# Altium schematic sheet Top Level.SchDoc
size A4
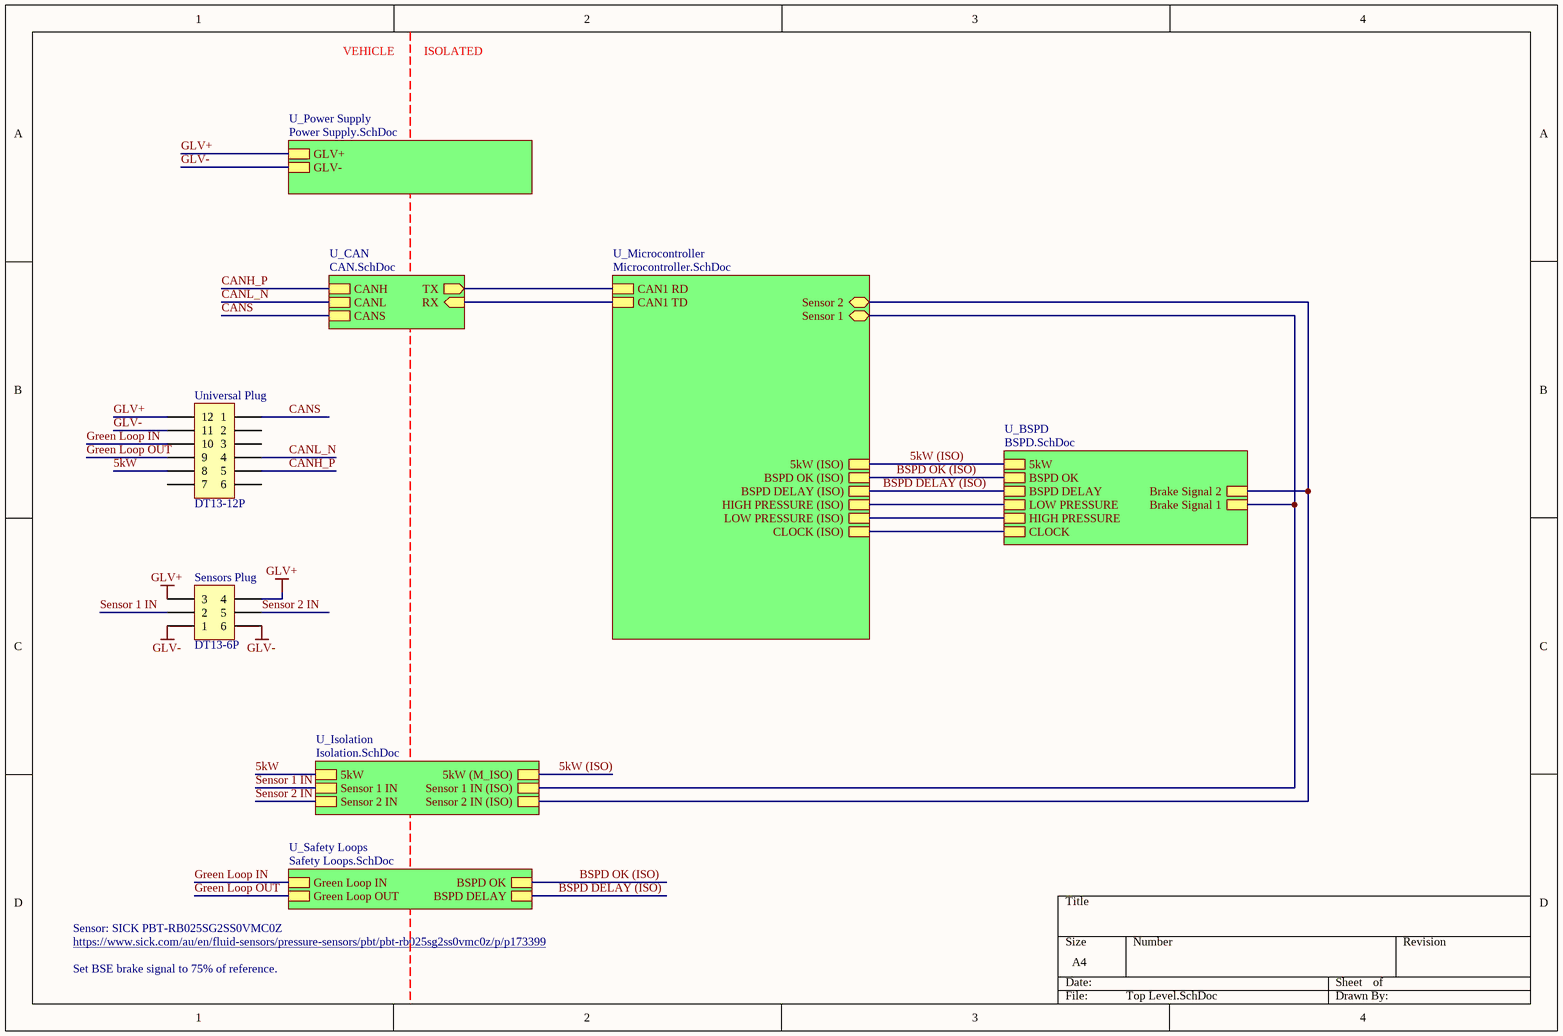
[diagram p0: Top Level.SchDoc]

## Parts
Sensors_Plug  DT13-6P  [DT13-6P]
Universal_Plug  DT13-12P  [DT13-12P]

## Sub-sheets
U_BSPD = BSPD.SchDoc: BSPD OK, HIGH PRESSURE, LOW PRESSURE, CLOCK, 5kW, Brake Signal 1, Brake Signal 2, BSPD DELAY
U_CAN = CAN.SchDoc: CANS, RX (in), CANL, CANH, TX (out)
U_Isolation = Isolation.SchDoc: 5kW, 5kW (M_ISO), Sensor 2 IN, Sensor 1 IN, Sensor 2 IN (ISO), Sensor 1 IN (ISO)
U_Microcontroller = Microcontroller.SchDoc: BSPD OK (ISO), 5kW (ISO), CLOCK (ISO), HIGH PRESSURE (ISO), LOW PRESSURE (ISO), Sensor 2 (bidir), Sensor 1 (bidir), CAN1 RD, CAN1 TD, BSPD DELAY (ISO)
U_Power Supply = Power Supply.SchDoc: GLV+, GLV-
U_Safety Loops = Safety Loops.SchDoc: Green Loop OUT, Green Loop IN, BSPD OK, BSPD DELAY

## Nets
GLV+: Sensors_Plug.3 Sensors_Plug.4 Universal_Plug.12 ; sheet U_Power Supply/GLV+
GLV-: Sensors_Plug.1 Sensors_Plug.6 Universal_Plug.11 ; sheet U_Power Supply/GLV-
5kW: Universal_Plug.8 ; sheet U_Isolation/5kW
5kW (ISO): sheet U_BSPD/5kW, sheet U_Microcontroller/5kW (ISO), sheet U_Isolation/5kW (M_ISO)
BSPD DELAY (ISO): sheet U_BSPD/BSPD DELAY, sheet U_Microcontroller/BSPD DELAY (ISO), sheet U_Safety Loops/BSPD DELAY
BSPD OK (ISO): sheet U_BSPD/BSPD OK, sheet U_Microcontroller/BSPD OK (ISO), sheet U_Safety Loops/BSPD OK
CANH_P: Universal_Plug.5 ; sheet U_CAN/CANH
CANL_N: Universal_Plug.4 ; sheet U_CAN/CANL
CANS: Universal_Plug.1 ; sheet U_CAN/CANS
Green Loop IN: Universal_Plug.10 ; sheet U_Safety Loops/Green Loop IN
Green Loop OUT: Universal_Plug.9 ; sheet U_Safety Loops/Green Loop OUT
Sensor 1 IN: Sensors_Plug.2 ; sheet U_Isolation/Sensor 1 IN
Sensor 2 IN: Sensors_Plug.5 ; sheet U_Isolation/Sensor 2 IN
(unnamed): sheet U_BSPD/HIGH PRESSURE, sheet U_Microcontroller/LOW PRESSURE (ISO)
(unnamed): sheet U_BSPD/LOW PRESSURE, sheet U_Microcontroller/HIGH PRESSURE (ISO)
(unnamed): sheet U_BSPD/CLOCK, sheet U_Microcontroller/CLOCK (ISO)
(unnamed): sheet U_BSPD/Brake Signal 1, sheet U_Microcontroller/Sensor 1, sheet U_Isolation/Sensor 1 IN (ISO)
(unnamed): sheet U_BSPD/Brake Signal 2, sheet U_Microcontroller/Sensor 2, sheet U_Isolation/Sensor 2 IN (ISO)
(unnamed): sheet U_Microcontroller/CAN1 RD, sheet U_CAN/TX
(unnamed): sheet U_Microcontroller/CAN1 TD, sheet U_CAN/RX

Not connected (* = marked no-connect by the designer): Universal_Plug 2 3 6 7

## Notes on the sheet
- VEHICLE
- ISOLATED
- Sensor: SICK PBT-RB025SG2SS0VMC0Z
- https://www.sick.com/au/en/fluid-sensors/pressure-sensors/pbt/pbt-rb025sg2ss0vmc0z/p/p173399
- Set BSE brake signal to 75% of reference.

## Library data of the parts
Sensors_Plug = DT13-6P[[/\]]DT13-6P: Positions: 6; Pitch: 4.44mm; Row Spacing: 6.35mm; Angle: 90; Flange: Yes; Contact: Copper Alloy; Part Number: DT13-6P; Digikey Part Number: 1734-1025-ND; Digikey Link: https://www.digikey.com/product-detail/en/te-connectivity-deutsch-connectors/DT13-6P/1734-1025-ND/6566589
Universal_Plug = DT13-12P[[/\]]DT13-12P: Positions: 12; Pitch: 4.44mm; Row Spacing: 6.35mm; Angle: 90; Flange: Yes; Contact: Nickel; Part Number: DT13-12P; Digikey Part Number: 1734-1451-ND; Digikey Link: https://www.digikey.com.au/product-detail/en/te-connectivity-deutsch-connectors/DT13-12PA/1734-1451-ND/7220123